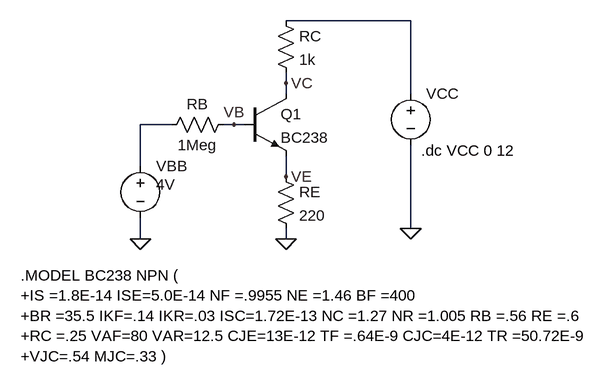
[diagram p0: schematic devre4.asc]
devre4.asc, the LTspice schematic file:
Version 4
SHEET 1 880 680
WIRE 384 -96 192 -96
WIRE 192 0 192 -16
WIRE 192 16 192 0
WIRE 384 16 384 -96
WIRE 16 64 -32 64
WIRE 112 64 96 64
WIRE 128 64 112 64
WIRE -32 128 -32 64
WIRE 192 144 192 112
WIRE 384 224 384 96
WIRE -32 240 -32 208
WIRE 192 240 192 224
FLAG -32 240 0
FLAG 384 224 0
FLAG 192 240 0
FLAG 112 64 VB
FLAG 192 144 VE
FLAG 192 0 VC
SYMBOL npn 128 16 R0
SYMATTR InstName Q1
SYMATTR Value BC238
SYMBOL res 176 -112 R0
SYMATTR InstName RC
SYMATTR Value 1k
SYMBOL res 176 128 R0
SYMATTR InstName RE
SYMATTR Value 220
SYMBOL res 112 48 R90
WINDOW 0 0 56 VBottom 2
WINDOW 3 32 56 VTop 2
SYMATTR InstName RB
SYMATTR Value 1Meg
SYMBOL voltage -32 112 R0
WINDOW 3 24 44 Left 2
WINDOW 123 0 0 Left 0
WINDOW 39 0 0 Left 0
SYMATTR Value 4V
SYMATTR InstName VBB
SYMBOL voltage 384 0 R0
WINDOW 123 0 0 Left 0
WINDOW 39 0 0 Left 0
SYMATTR InstName VCC
SYMATTR Value ""
TEXT -216 296 Left 2 !.MODEL BC238 NPN (\n+IS =1.8E-14 ISE=5.0E-14 NF =.9955 NE =1.46 BF =400\n+BR =35.5 IKF=.14 IKR=.03 ISC=1.72E-13 NC =1.27 NR =1.005 RB =.56 RE =.6\n+RC =.25 VAF=80 VAR=12.5 CJE=13E-12 TF =.64E-9 CJC=4E-12 TR =50.72E-9\n+VJC=.54 MJC=.33 )
TEXT 400 104 Left 2 !.dc VCC 0 12

The netlist it stands for:
* devre4.asc
Q1 VC VB VE 0 BC238
RC N001 VC 1k
RE VE 0 220
RB VB N002 1Meg
VBB N002 0 4V
VCC N001 0
.model NPN NPN
.model PNP PNP
.lib standard.bjt
.MODEL BC238 NPN (
+IS =1.8E-14 ISE=5.0E-14 NF =.9955 NE =1.46 BF =400
+BR =35.5 IKF=.14 IKR=.03 ISC=1.72E-13 NC =1.27 NR =1.005 RB =.56 RE =.6
+RC =.25 VAF=80 VAR=12.5 CJE=13E-12 TF =.64E-9 CJC=4E-12 TR =50.72E-9
+VJC=.54 MJC=.33 )
.dc VCC 0 12
.backanno
.end